# Altium project GPS_WATHER_STATION.PrjPcb
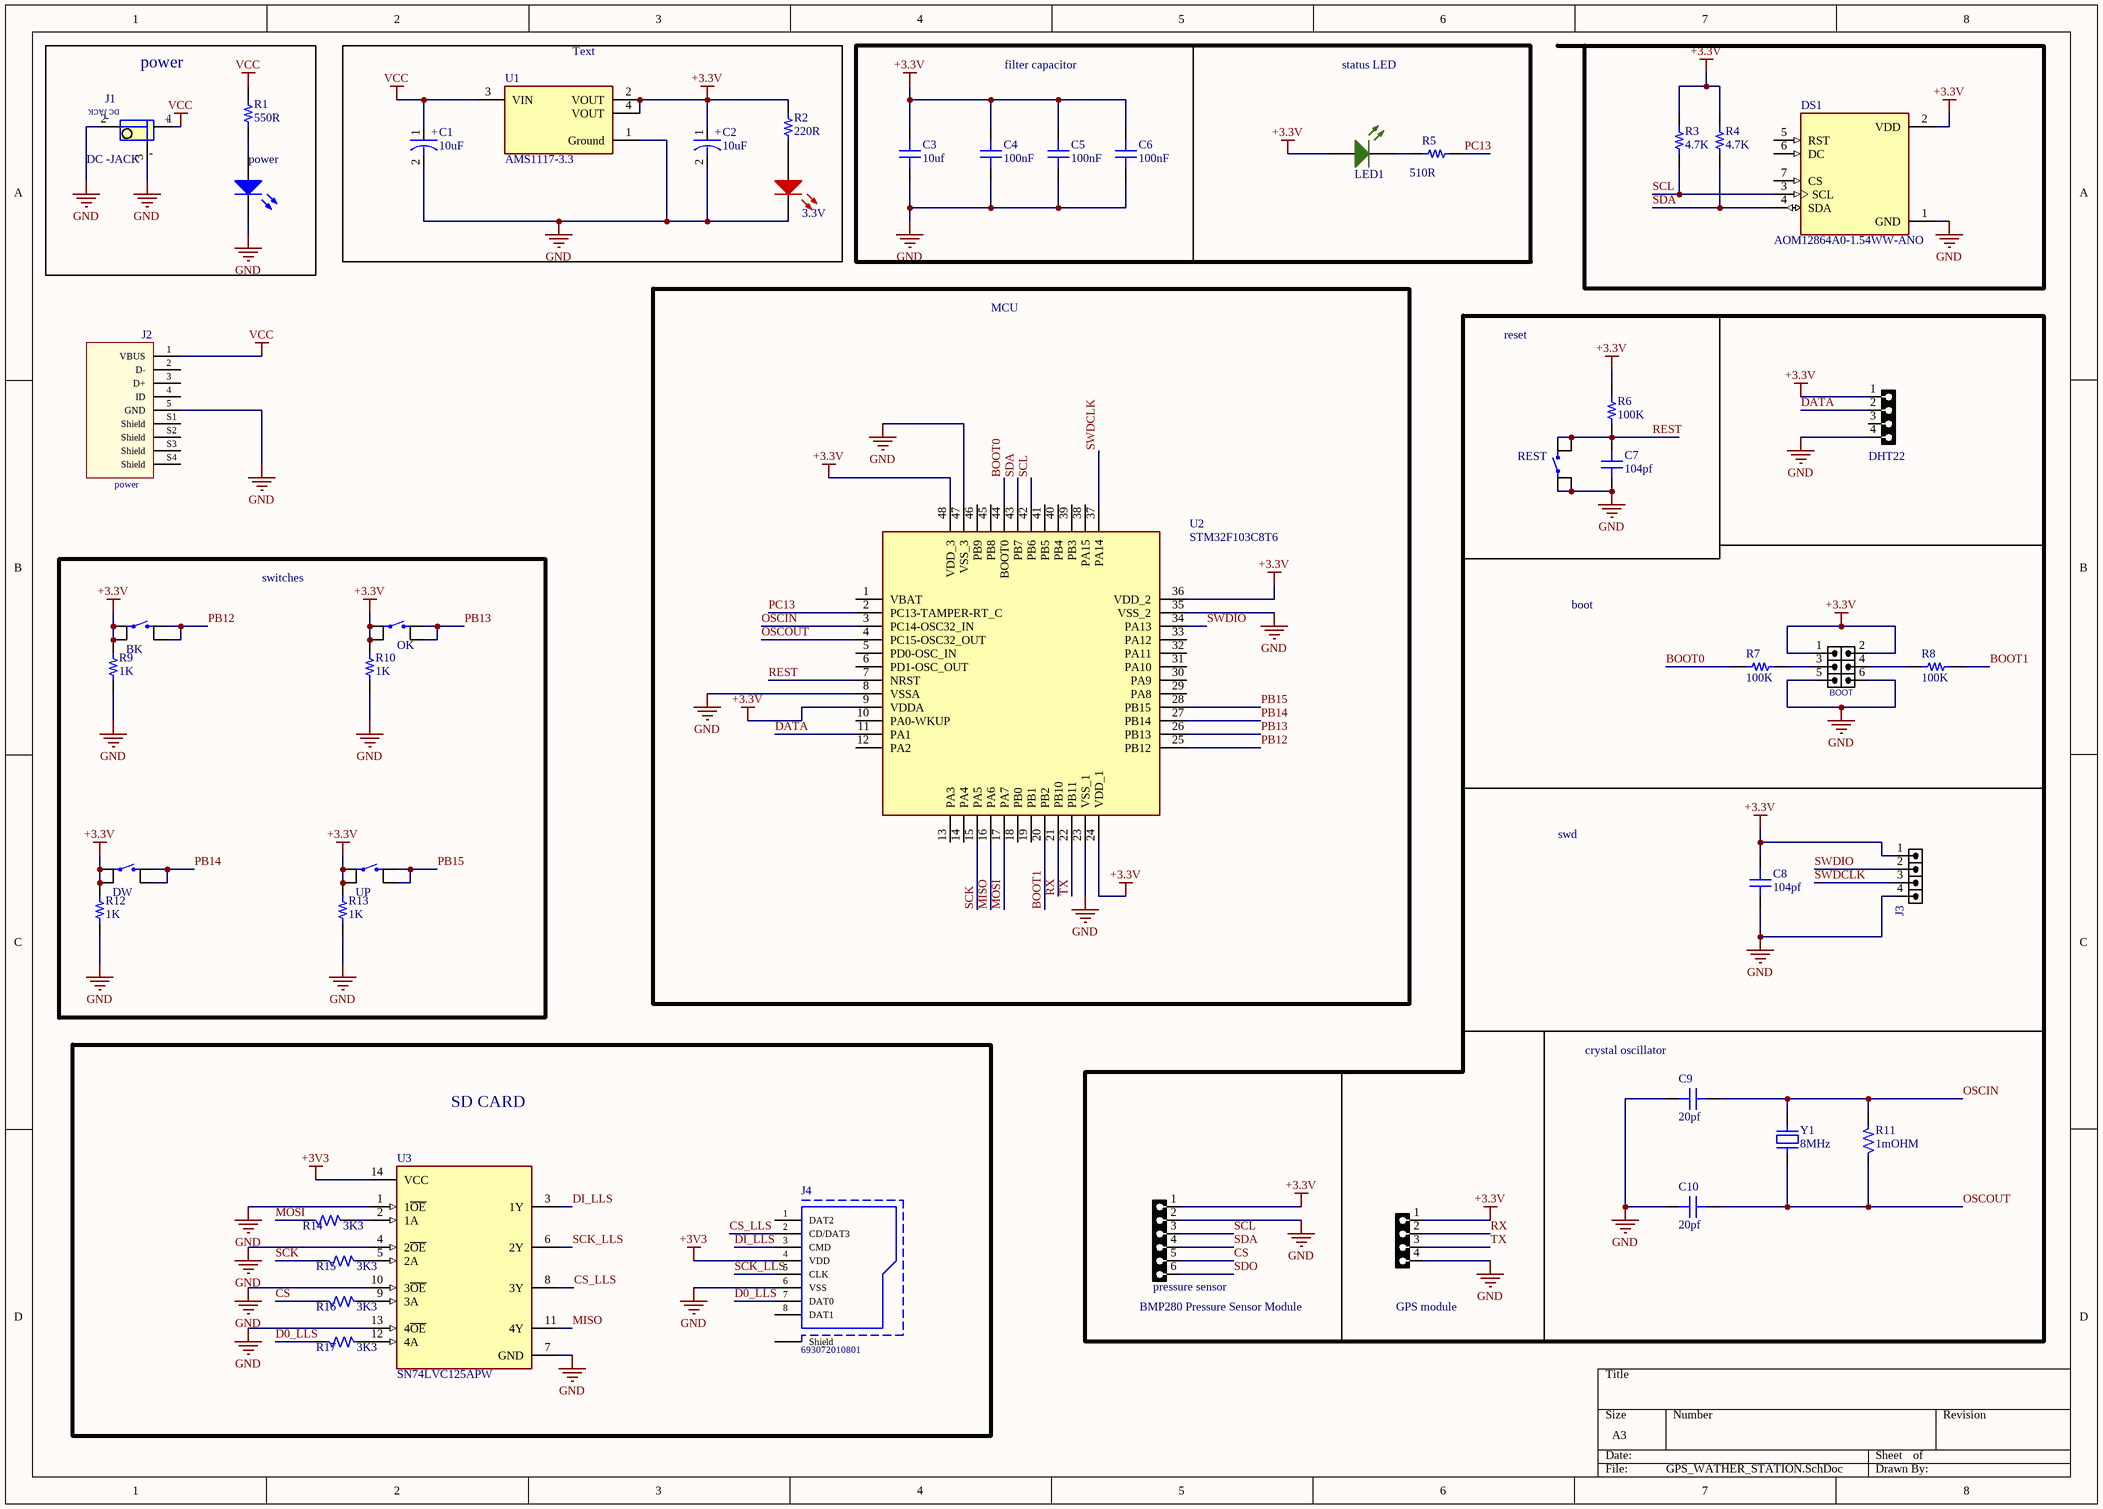
[diagram p0: GPS_WATHER_STATION.SchDoc]
1 sheet, 48 parts. Net scope: global (net labels, ports and power ports of the same name join across sheets).
Board file: GPS_WATHER_STATION.PcbDoc

## Sheet GPS_WATHER_STATION.SchDoc
size A3; SheetNumber: 1; SheetTotal: 1

### Parts
3.3V  LED SMD 0603 RED  [LED_0603_BLUE]  (value not drawn)
BK  Tactile 4PIN 6X6mm H4.5mm (SMD)  [SWPBS_SPDT_6X6X5]  (value not drawn)
BOOT  HDRM_2X3  [HDRS_M_2X3]  (value not drawn)
C1  10uF  [CAP-T_1206]
C2  10uF  [CAP-T_1206]
C3  10uf  [CAP 0402_1005]
C4  100nF  [CAP 0402_1005]
C5  100nF  [CAP 0402_1005]
C6  100nF  [CAP 0402_1005]
C7  104pf  [CAP 0402_1005]
C8  104pf  [CAP 0402_1005]
C9  20pf  [CAP 0402_1005]
C10  20pf  [CAP 0402_1005]
DHT22  HDRF4  [HDRLP_F_1X4]  (value not drawn)
DS1  AOM12864A0-1.54WW-ANO  [LCD_AOM12864A0-1.54WW-ANO]
DW  Tactile 4PIN 6X6mm H4.5mm (SMD)  [SWPBS_SPDT_6X6X5]  (value not drawn)
GPS_module  HDRF4  [HDRLP_F_1X4]  (value not drawn)
J1  DC -JACK  [CON3_129_PJ-002A_TH_RA]
J2  power  [629105150521]
J3  HDR1X4  [HDRR_M_1X4]  (value not drawn)
J4  693072010801  [693072010801]
LED1  LED SMD 0603 GREEN  [LED_0603_GREEN]  (value not drawn)
OK  Tactile 4PIN 6X6mm H4.5mm (SMD)  [SWPBS_SPDT_6X6X5]  (value not drawn)
power  LED SMD 0603 BLUE  [LED_0603_RED]  (value not drawn)
pressure_sensor  HDRF6  [HDRLP_F_1X6]  (value not drawn)
R1  550R  [RES 0402_1005]
R2  220R  [RES 0402_1005]
R3  4.7K  [RES 0402_1005]
R4  4.7K  [RES 0402_1005]
R5  510R  [RES 0402_1005]
R6  100K  [RES 0402_1005]
R7  100K  [RES 0402_1005]
R8  100K  [RES 0402_1005]
R9  1K  [RES 0402_1005]
R10  1K  [RES 0402_1005]
R11  1mOHM  [RES_0805]
R12  1K  [RES 0402_1005]
R13  1K  [RES 0402_1005]
R14  3K3  [RES_0603]
R15  3K3  [RES_0603]
R16  3K3  [RES_0603]
R17  3K3  [RES_0603]
REST  Tactile 4PIN 6X6mm H4.5mm (SMD)  [SWPBS_SPDT_6X6X5]  (value not drawn)
U1  AMS1117-3.3  [FP-AMS1117-IPC_C]
U2  STM32F103C8T6  [LQFP-48_19.6_393_58X11_SMD]
U3  SN74LVC125APW  [FP-PW0014A-IPC_C]
UP  Tactile 4PIN 6X6mm H4.5mm (SMD)  [SWPBS_SPDT_6X6X5]  (value not drawn)
Y1  8MHz  [HC-49S SMD]

### Blocks framed on the sheet
power: J1 power R1
Text: 3.3V C1 C2 R2 U1
MCU: U2
switches: BK DW OK R9 R10 R12 R13 UP
SD CARD: J4 R14-R17 U3

### Nets
+3.3V: BK.1 BK.4 BOOT.1 BOOT.2 C2.1 C3.2 C4.2 C5.2 C6.2 C8.2 DHT22.1 DS1.2(VDD) DW.1 DW.4 GPS_module.1 J3.1 LED1.1(A) OK.1 OK.4 pressure_sensor.1 R2.2 R3.2 R4.2 R6.1 R9.2 R10.2 R12.2 R13.2 U1.2(VOUT) U1.4(VOUT) U2.9(VDDA) U2.24(VDD_1) U2.36(VDD_2) U2.48(VDD_3) UP.1 UP.4
+3V3: J4.4(VDD) U3.14(VCC)
GND: 3.3V.2(K) BOOT.5 BOOT.6 C1.2 C2.2 C3.1 C4.1 C5.1 C6.1 C7.1 C8.1 C9.2 C10.2 DHT22.4 DS1.1(GND) GPS_module.4 J1.2 J1.3(-) J2.5(GND) J3.4 J4.6(VSS) power.2(K) pressure_sensor.2 R9.1 R10.1 R12.1 R13.1 REST.1 REST.4 U1.1(Ground) U2.8(VSSA) U2.23(VSS_1) U2.35(VSS_2) U2.47(VSS_3) U3.1(1~{OE}) U3.4(2~{OE}) U3.7(GND) U3.10(3~{OE}) U3.13(4~{OE})
VCC: C1.1 J1.1 J2.1(VBUS) R1.2 U1.3(VIN)
BOOT0: R7.2 U2.44(BOOT0)
BOOT1: R8.1 U2.20(PB2)
CS: pressure_sensor.5 R16.1
CS_LLS: J4.2(CD/DAT3) U3.8(3Y)
D0_LLS: J4.7(DAT0) R17.1
DATA: DHT22.2 U2.11(PA1)
DI_LLS: J4.3(CMD) U3.3(1Y)
MISO: U2.16(PA6) U3.11(4Y)
MOSI: R14.1 U2.17(PA7)
OSCIN: C9.1 R11.2 U2.3(PC14-OSC32_IN) Y1.2
OSCOUT: C10.1 R11.1 U2.4(PC15-OSC32_OUT) Y1.1
PB12: BK.2 BK.3 U2.25(PB12)
PB13: OK.2 OK.3 U2.26(PB13)
PB14: DW.2 DW.3 U2.27(PB14)
PB15: U2.28(PB15) UP.2 UP.3
PC13: R5.1 U2.2(PC13-TAMPER-RT_C)
REST: C7.2 R6.2 REST.2 REST.3 U2.7(NRST)
RX: GPS_module.2 U2.21(PB10)
SCK: R15.1 U2.15(PA5)
SCK_LLS: J4.5(CLK) U3.6(2Y)
SCL: DS1.3(SCL) pressure_sensor.3 R3.1 U2.42(PB6)
SDA: DS1.4(SDA) pressure_sensor.4 R4.1 U2.43(PB7)
SDO: pressure_sensor.6
SWDCLK: J3.3 U2.37(PA14)
SWDIO: J3.2 U2.34(PA13)
TX: GPS_module.3 U2.22(PB11)
Net3.3V_1: 3.3V.1(A) R2.1
NetBOOT_3: BOOT.3 R7.1
NetBOOT_4: BOOT.4 R8.2
NetLED1_2: LED1.2(K) R5.2
Netpower_1: power.1(A) R1.1
NetR14_2: R14.2 U3.2(1A)
NetR15_2: R15.2 U3.5(2A)
NetR16_2: R16.2 U3.9(3A)
NetR17_2: R17.2 U3.12(4A)

Not connected (* = marked no-connect by the designer): DHT22 3; DS1 5(RST) 6(DC) 7(CS); J2 2(D-) 3(D+) 4(ID) S1(Shield) S2(Shield) S3(Shield) S4(Shield); J4 1(DAT2) 8(DAT1) Shield; U2 1(VBAT) 5(PD0-OSC_IN) 6(PD1-OSC_OUT) 10(PA0-WKUP) 12(PA2) 13(PA3) 14(PA4) 18(PB0) 19(PB1) 29(PA8) 30(PA9) 31(PA10) 32(PA11) 33(PA12) 38(PA15) 39(PB3) 40(PB4) 41(PB5) 45(PB8) 46(PB9)

### Notes on the sheet
- filter capacitor
- status LED
- reset
- boot
- swd
- (near C9) crystal oscillator
- (near pressure_sensor) BMP280 Pressure Sensor Module
- (in symbol CAP-P_10uF-16V-10%-1206) +
- (in symbol CON-PLG_3X1-228-DC_JACK) DC JACK; +

### Library data of the parts
BK DW OK REST UP = Tactile 4PIN 6X6mm H4.5mm (SMD): Tactile Switch SPST-NO Top Actuated Surface Mount; PartNumber: PTS645SM43SMTR92 LFS
BOOT = HDRS_M_2X3: CONN, HEADER, Male, pitch: 2.54mm, 6POS, SMD; MANF_P#: MANF_PART#; MANF: MANF; VALUE: HDRM_2X3
C1 C2 = CAP-P_10uF-16V-10%-1206: 10µF Molded Tantalum Capacitors 16V 1206 (3216 Metric) 3Ohm; Manufacturer: AVX Corporation; Manufacturer Part Number: TAJA106K016SNJ; Alternate Part Number-1: CA45-A016K106T; Case/Package: 1206; Supplier-1: SIRICOM; Supplier Part Number-1: TAJA106K016SNJ
C3 C7-C10 = Cap 0402: SMT Capacitor; VALUE: 100nF
C4-C6 = Cap 0402: SMT Capacitor; VALUE: 100nF
DHT22 GPS_module = HDRLP_F_1X4: CONN, HEADER, Male, pitch: 2.54mm, 4POS; VALUE: HDRF4
DS1 = AOM12864A0-1.54WW-ANO: Non-Touch Graphic LCD Display Module - White OLED SPI 1.54 (39.12mm) 128 x 64; MF: Orient Display; Price: None; Value: *; Package: None; Check_prices: https://www.snapeda.com/parts/AOM12864A0-1.54WW-ANO/Orient+Display/view-part/?ref=eda; SnapEDA_Link: https://www.snapeda.com/parts/AOM12864A0-1.54WW-ANO/Orient+Display/view-part/?ref=snap; Purchase-URL: https://pricing.snapeda.com/search/part/AOM12864A0-1.54WW-ANO/?ref=eda; Availability: In Stock; MP: AOM12864A0-1.54WW-ANO
J1 = CON-PLG_3X1-228-DC_JACK: 3 Pins, 1 Row 228mil Pitch, right angle Connector, male; Manufacturer: JST; Manufacturer Part Number: PJ-002A; Alternate Part Number-1: NA; Case/Package: TH-CON; Supplier-1: SP ROAD; Supplier Part Number-1: NA
J2 = Micro USB 2.0 Type B Horizontal (SMD) 629105150521: Micro USB 2.0 Type B Horizontal SMT 5 Contacts High Current WR-COM; Rated Current: 3 A; Gender: Female; ComponentLink1Description: Manufacturer; ComponentLink1URL: http://www.we-online.de; ComponentLink2Description: Datasheet; ComponentLink2URL: http://katalog.we-online.de/em/datasheet/629105150521.pdf; PartNumber: 629105150521; Published Date: May 2018; Publisher: Wurth Elektronik; Orientation: Horizontal; Interface Type: Micro USB 2.0 Type B; Operating Temperature: -40 to 85 degC; Mounting Technology: SMT; Packaging: Tape and Reel
J3 = HDRR_M_1X4: CONN, HEADER, RightAngle, Male, pitch: 2.54mm, 4POS; VALUE: HDRM4
J4 = CMP-1502-00164-1: WR-CRD Micro SD Card Connector, Hinge Type; Manufacturer: Wurth Elektronik; Withstanding Voltage: 500VAC; Rated Current: 0.5A; Working Voltage: 100VAC; Datasheet URL: https://katalog.we-online.de/em/datasheet/693072010801.pdf; Part Number: 693072010801; Publisher: WurthElektronik; Manufacturer URL: http://www.we-online.de; Mounting Technology: SMT; Package Reference: 693072010801; Packaging: TapeandReel; Operating Temperature: -25to85degC
pressure_sensor = HDRLP_F_1X6: CONN, HEADER, Male, pitch: 2.54mm, 6POS; VALUE: HDRF6
R1-R8 = Res 0402: SMT Resistor; VALUE: 1K
R9 R10 R12 R13 = Res 0402: SMT Resistor; VALUE: 1K
R11 = RES_1mOHM-0.125W-0.25%-0805: 1.02 MOhms ±0.25% 0.125W, 1/8W Chip Resistor 0805 (2012 Metric) Thin Film; Manufacturer: Vishay Dale; Manufacturer Part Number: RT0805CRE071M02L; Alternate Part Number-1: NA; Case/Package: 0805; Supplier-1: Mouser; Supplier Part Number-1: RT0805CRE071M02L
R14-R17 = RES_3.3K-0.1W-1%-0603: 3.3 kOhms ±1% 0.1W, 1/10W Chip Resistor 0603 (1608 Metric) Automotive AEC-Q200 Thick Film; Manufacturer: Wilson; Manufacturer Part Number: WR06X3301FTL; Alternate Part Number-1: 0603WAF3301T5E; Case/Package: 0603; Supplier-1: SIRICOM; Supplier Part Number-1: WR06X3301FTL
U1 = CMP-209535-000001-1: LDO Voltage Regulators 1A, 3.3V; Manufacturer: Advanced Monolithic Systems; Dropout Voltage: 1.1V; Output Type: Fixed; Nominal Supply Current: 5mA; Max Power Dissipation: 1.2W; Max Supply Voltage: 15V; Number Of Outputs: 1; Standoff Height: 0.64mm; Max Junction Temp: +125°C; Height: 1.8mm; Package: AMS1117; Device Class L2: Power Management ICs; ComponentLink2Description: Datasheet; ComponentLink2URL: http://www.advanced-monolithic.com/pdf/ds1117.pdf; Category: IC; RoHS: TRUE; Automotive: No; Device Class L1: Integrated Circuits (ICs); Output Current: 1A; Device Class L3: Voltage Regulators - Linear; Temperature: -40°C to +125°C; Output Voltage: 3.3V; Manufacturer Part Number: AMS1117-3.3; Temperature Range Low: -40°C; Octopart: https://octopart.com/ams1117-3.3-advanced+monolithic+systems-25899300; Lead Free: Yes; Ipc Land Pattern Name: SOT229P700X180-4; Temperature Range High: +125°C
U2 = IC_STM32F103C8T6: ARM® Cortex®-M3 STM32F1 Microcontroller IC 32-Bit 72MHz 64KB (64K x 8) FLASH 48-LQFP (7x7); Manufacturer: STMicroelectronics; Alternate Part Number-1: NA; Manufacturer Part Number: STM32F103C8T6; Case/Package: LQFP48; Supplier-1: LCSC; Supplier Part Number-1: STM32F103C8T6
U3 = CMP-0440-00180-4: IC BUF NON-INVERT 3.6V 14TSSOP; Polarity: Non-Inverting; Turn-On Delay Time: 15.8ns; Operating Supply Voltage: 1.8V; Number of Inputs: 4; High Level Output Current: -24mA; Max Power Dissipation: 500mW; Output Type: 3-STATE; Propagation Delay: 4.6ns; Number of Bits per Element: 1; Min Supply Voltage: 1.65V; Logic Function: Buffer; Number of Output Lines: 3; Low Level Output Current: 24mA; Quiescent Current: 1uA; Mount: Surface Mount; Number of Elements: 4; Max Operating Temperature: 125°C; Number of Input Lines: 4; Series: 74LVC; Termination: SMD/SMT; Number of Channels: 4; Max Supply Voltage: 3.6V; Number of Bits: 4; REACH SVHC: No SVHC; Length: 5mm; Technology: CMOS; Number of Pins: 14; Lead Free: Lead Free; RoHS Compliant: Yes; Radiation Hardening: No; Packaging: Rail/Tube; Width: 4.4mm; Min Operating Temperature: -40°C; Height: 1.15mm; Number of Outputs: 4; Package Quantity: 90; Case/Package: TSSOP
Y1 = Crystal HC-49S SMD 8MHz: SMT Crystal; PartNumber: ABLS-8.000MHZ-K4T